# EAGLE design carcomputer2 (EAGLE 9.3.2)
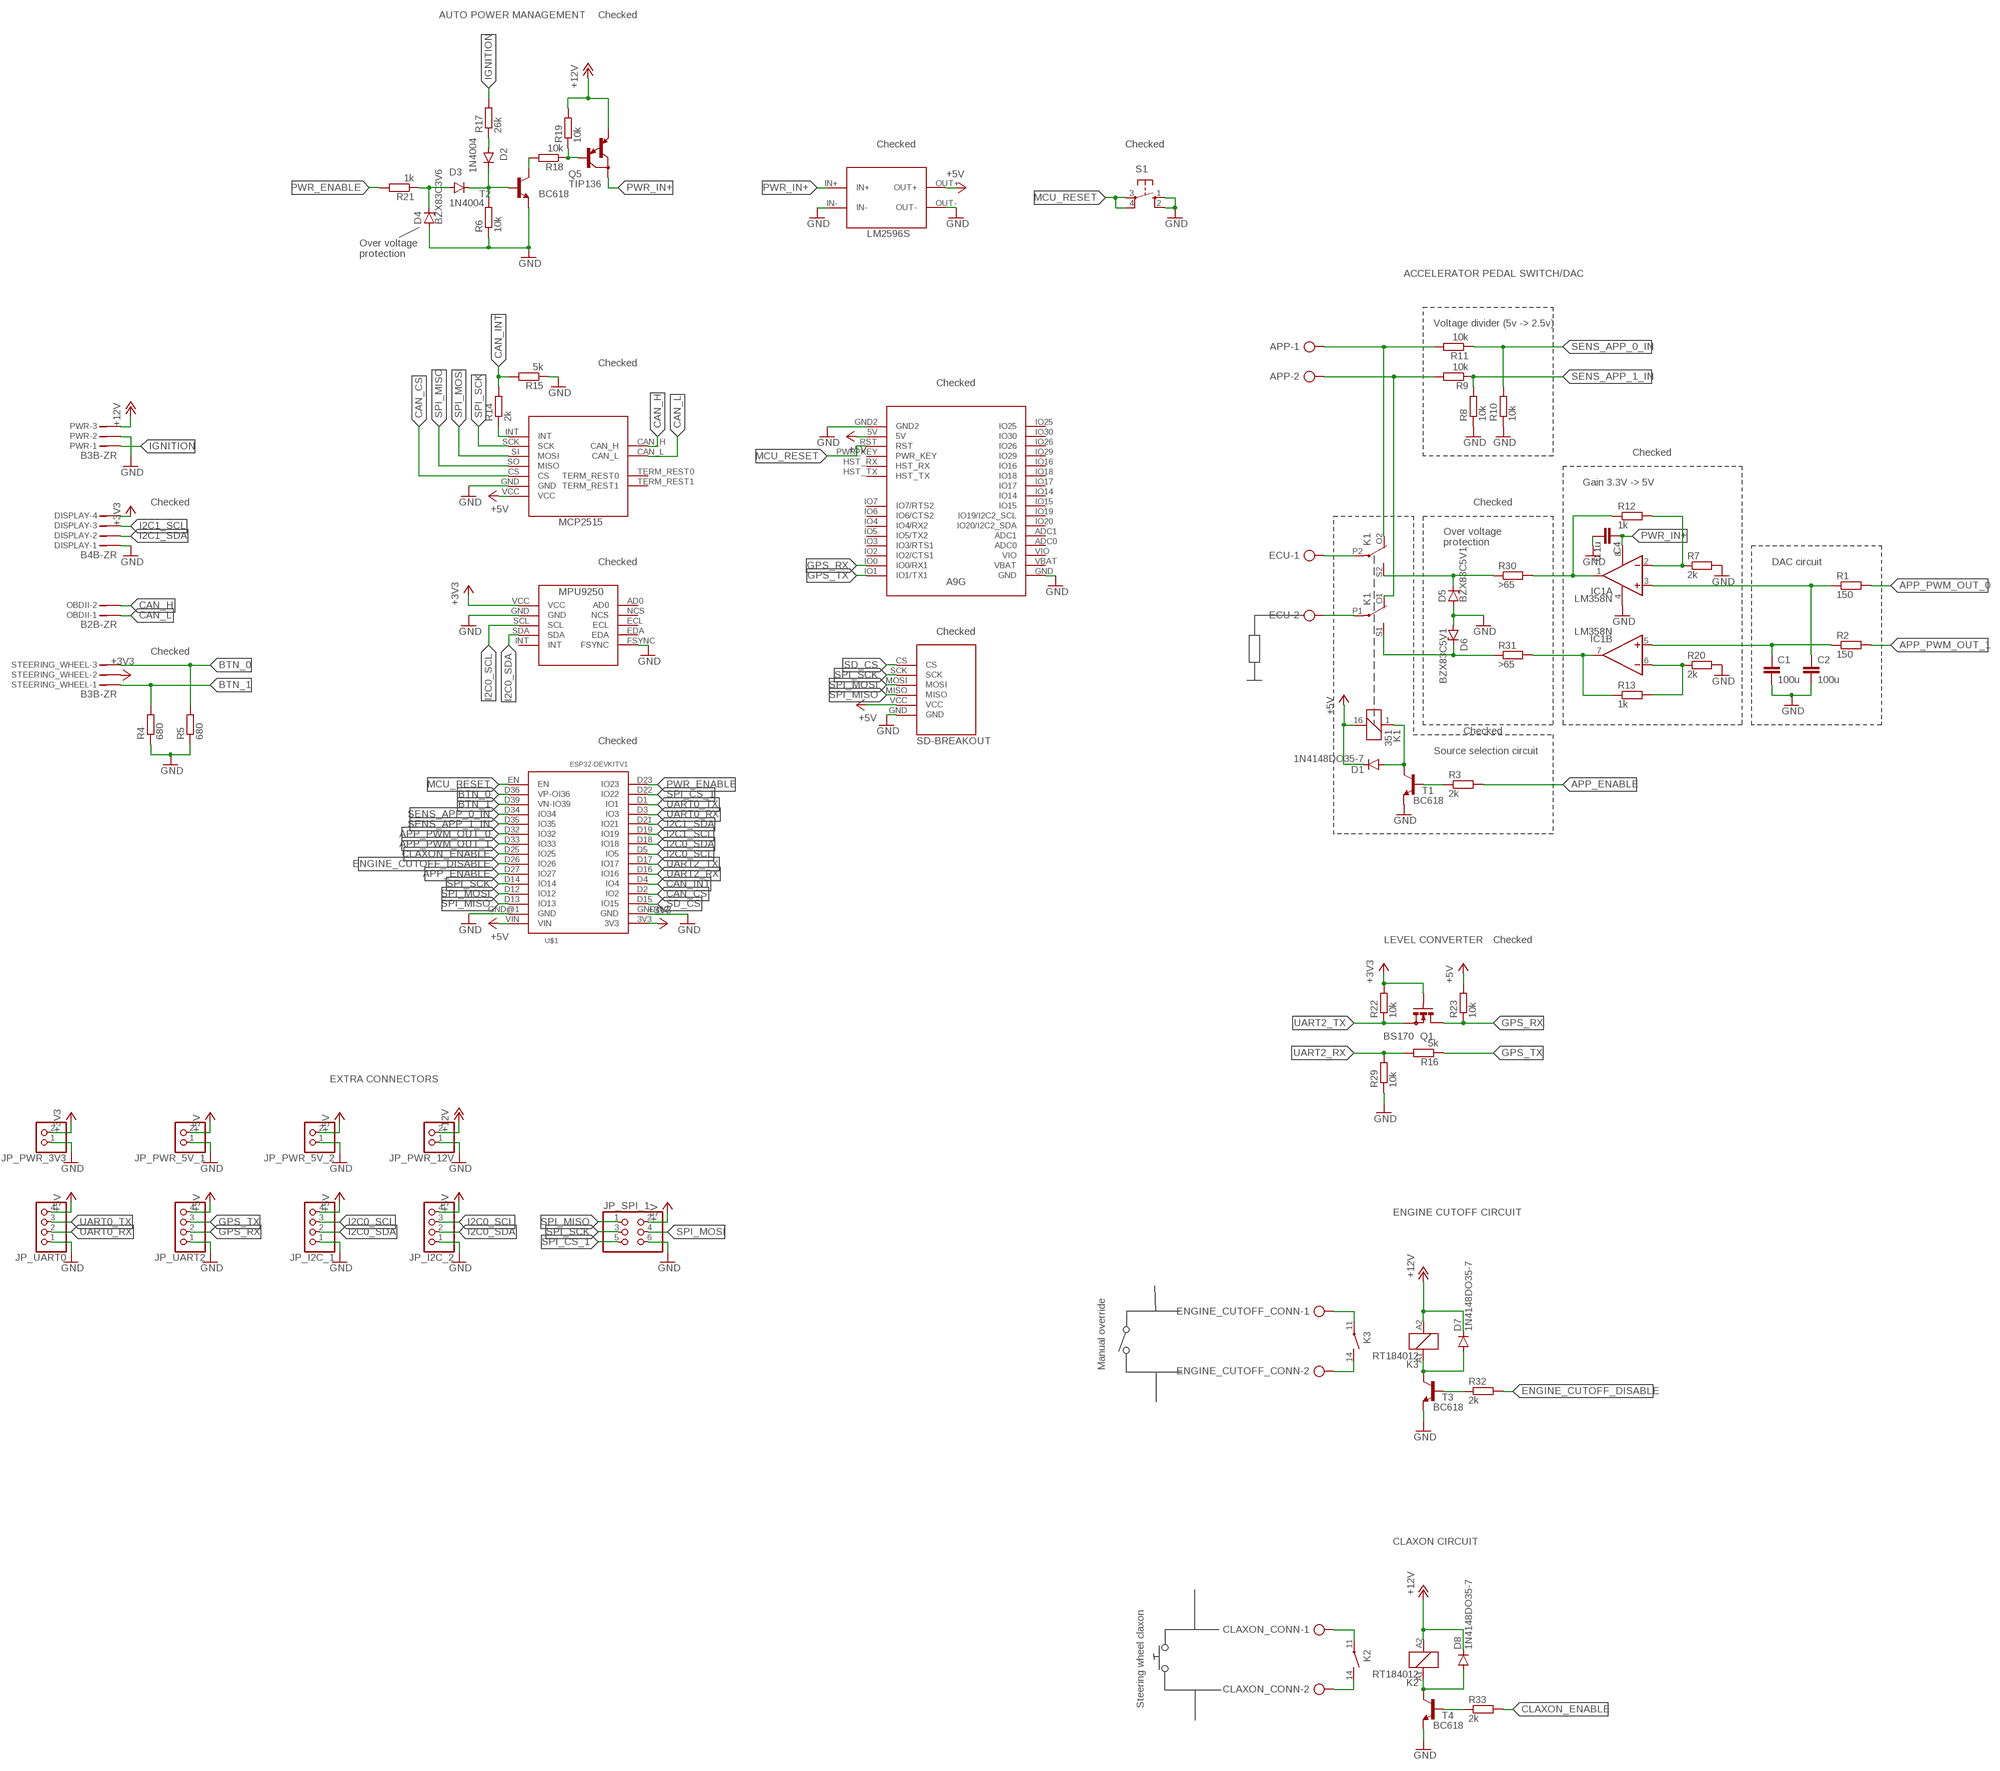
[diagram p0: schematic, sheet 1]

## Parts
APP  AK300/2  [AK300/2]
C1  100u  C-EU025-050X050  [C025-050X050]
C2  100u  C-EU025-050X050  [C025-050X050]
C4  0.1u  C-EU025-050X050  [C025-050X050]
CLAXON_CONN  AK300/2  [AK300/2]
D1  1N4148DO35-7  [DO35-7]
D2  1N4004  [DO41-10]
D3  1N4004  [DO41-10]
D4  BZX83C3V6  BZX85  [DO41Z10]
D5  BZX83C5V1  BZX85  [DO41Z10]
D6  BZX83C5V1  BZX85  [DO41Z10]
D7  1N4148DO35-7  [DO35-7]
D8  1N4148DO35-7  [DO35-7]
DISPLAY  B4B-ZR  [B4B-ZR]
ECU  AK300/2  [AK300/2]
ENGINE_CUTOFF_CONN  AK300/2  [AK300/2]
IC1  LM358N  [DIL08]
JP_I2C_1  PINHD-1X4  [1X04]
JP_I2C_2  PINHD-1X4  [1X04]
JP_PWR_3V3  PINHD-1X2  [1X02]
JP_PWR_5V_1  PINHD-1X2  [1X02]
JP_PWR_5V_2  PINHD-1X2  [1X02]
JP_PWR_12V  PINHD-1X2  [1X02]
JP_SPI_1  PINHD-2X3  [2X03]
JP_UART0  PINHD-1X4  [1X04]
JP_UART2  PINHD-1X4  [1X04]
K1  351  [351]
K2  RT184012  [RT-N/O12A3.5]
K3  RT184012  [RT-N/O12A3.5]
OBDII  B2B-ZR  [B2B-ZR]
PWR  B3B-ZR  [B3B-ZR]
Q1  BS170  [SOT54E]
Q5  TIP136  [TO220]
R1  150  R-EU_0207/7  [0207/7]
R2  150  R-EU_0207/7  [0207/7]
R3  2k  R-EU_0207/7  [0207/7]
R4  680  R-EU_0207/7  [0207/7]
R5  680  R-EU_0207/7  [0207/7]
R6  10k  R-EU_0207/7  [0207/7]
R7  2k  R-EU_0207/7  [0207/7]
R8  10k  R-EU_0207/7  [0207/7]
R9  10k  R-EU_0207/7  [0207/7]
R10  10k  R-EU_0207/7  [0207/7]
R11  10k  R-EU_0207/7  [0207/7]
R12  1k  R-EU_0207/7  [0207/7]
R13  1k  R-EU_0207/7  [0207/7]
R14  2k  R-EU_0207/7  [0207/7]
R15  5k  R-EU_0207/7  [0207/7]
R16  5k  R-EU_0207/7  [0207/7]
R17  26k  R-EU_0207/7  [0207/7]
R18  10k  R-EU_0207/7  [0207/7]
R19  10k  R-EU_0207/7  [0207/7]
R20  2k  R-EU_0207/7  [0207/7]
R21  1k  R-EU_0207/7  [0207/7]
R22  10k  R-EU_0207/7  [0207/7]
R23  10k  R-EU_0207/7  [0207/7]
R29  10k  R-EU_0207/7  [0207/7]
R30  >65  R-EU_0207/7  [0207/7]
R31  >65  R-EU_0207/7  [0207/7]
R32  2k  R-EU_0207/7  [0207/7]
R33  2k  R-EU_0207/7  [0207/7]
S1  10-XX  [B3F-10XX]
STEERING_WHEEL  B3B-ZR  [B3B-ZR]
T1  BC618  [TO92-EBC]
T2  BC618  [TO92-EBC]
T3  BC618  [TO92-EBC]
T4  BC618  [TO92-EBC]
U$1  ESP32DEVKITV1  [ESP32-DEVKITV1]
U$2  MCP2515_DEVBOARDINVERTED  [MCP2515_DEVBOARD_INVERTED]
U$3  MPU9250_BREAKOUT  [MPU9250_BREAKOUT]
U$4  LM2596S  [LM2596S]
U$5  HKD-MICRO-SD-BREAKOUT  [HKD-MICRO-SD-BREAKOUT]
U$6  A9G  [A9G]

## Nets
+3V3: DISPLAY.4 JP_PWR_3V3.2 Q1.G R22.2 STEERING_WHEEL.2 U$1.3V3 U$3.VCC
+5V: D1.C JP_I2C_1.4 JP_I2C_2.4 JP_PWR_5V_1.2 JP_PWR_5V_2.2 JP_SPI_1.2 JP_UART0.4 JP_UART2.4 K1.16 R23.2 U$1.VIN U$2.VCC U$4.OUT+ U$5.VCC U$6.5V
+12V: D7.C D8.C JP_PWR_12V.2 K2.A2 K3.A2 PWR.3 Q5.3(E) R19.2
APP_0_IN: APP.1 K1.O2(3:O) R11.2
APP_1_IN: APP.2 K1.O1(2:O) R9.2
APP_ENABLE: R3.2 U$1.D27(IO27)
APP_PWM_OUT_0: R1.2 U$1.D32(IO32)
APP_PWM_OUT_1: R2.2 U$1.D33(IO33)
BTN_0: R5.2 STEERING_WHEEL.3 U$1.D36(VP-OI36)
BTN_1: R4.2 STEERING_WHEEL.1 U$1.D39(VN-IO39)
CAN_CS: U$1.D2(IO2) U$2.CS
CAN_H: OBDII.2 U$2.CAN_H
CAN_INT: R14.2 R15.2 U$1.D4(IO4)
CAN_L: OBDII.1 U$2.CAN_L
CLAXON_ENABLE: R33.2 U$1.D25(IO25)
ENGINE_CUTOFF_DISABLE: R32.2 U$1.D26(IO26)
GND: C1.2 C2.2 C4.2 D4.A D5.A D6.A DISPLAY.1 IC1.4(P:V-) JP_I2C_1.1 JP_I2C_2.1 JP_PWR_3V3.1 JP_PWR_5V_1.1 JP_PWR_5V_2.1 JP_PWR_12V.1 JP_SPI_1.6 JP_UART0.1 JP_UART2.1 PWR.2 R4.1 R5.1 R6.1 R7.2 R8.1 R10.1 R15.1 R20.2 R29.1 S1.1(S) S1.2(S1) T1.E T2.E T3.E T4.E U$1.GND@1(GND) U$1.GND@2(GND) U$2.GND U$3.FSYNC U$3.GND U$4.IN- U$4.OUT- U$5.GND U$6.GND U$6.GND2
GPS_RX: JP_UART2.2 Q1.D R23.1 U$6.IO0(IO0/RX1)
GPS_TX: JP_UART2.3 R16.1 U$6.IO1(IO1/TX1)
I2C0_SCL: JP_I2C_1.3 JP_I2C_2.3 U$1.D5(IO5) U$3.SCL
I2C0_SDA: JP_I2C_1.2 JP_I2C_2.2 U$1.D18(IO18) U$3.SDA
I2C1_SCL: DISPLAY.3 U$1.D19(IO19)
I2C1_SDA: DISPLAY.2 U$1.D21(IO21)
IGNITION: PWR.1 R17.2
MCU_RESET: S1.3(P) S1.4(P1) U$1.EN U$6.RST
N$1: D1.A K1.1 T1.C
N$2: R3.1 T1.B
N$3: D6.C K1.S1(2:S) R31.1
N$4: IC1.1(A:OUT) R12.1 R30.2
N$5: D2.C D3.C R6.2 T2.B
N$6: ECU.2 K1.P1(2:P)
N$7: ECU.1 K1.P2(3:P)
N$8: C2.1 IC1.3(A:+IN) R1.1
N$9: C1.1 IC1.5(B:+IN) R2.1
N$10: R14.1 U$2.INT
N$11: D3.A D4.C R21.1
N$12: D2.A R17.1
N$13: IC1.2(A:-IN) R7.1 R12.2
N$14: Q5.1(B) R18.1 R19.1
N$15: R18.2 T2.C
N$16: IC1.6(B:-IN) R13.2 R20.1
N$17: D5.C K1.S2(3:S) R30.1
N$18: IC1.7(B:OUT) R13.1 R31.2
N$19: ENGINE_CUTOFF_CONN.1 K3.11(2:P)
N$20: ENGINE_CUTOFF_CONN.2 K3.14(2:S)
N$22: D7.A K3.A1 T3.C
N$23: D8.A K2.A1 T4.C
N$25: R33.1 T4.B
N$26: R32.1 T3.B
N$27: CLAXON_CONN.1 K2.11(2:P)
N$28: CLAXON_CONN.2 K2.14(2:S)
PWR_ENABLE: R21.2 U$1.D23(IO23)
PWR_IN+: C4.1 IC1.8(P:V+) Q5.2(C) U$4.IN+
SD_CS: U$1.D15(IO15) U$5.CS
SENS_APP_0_IN: R10.2 R11.1 U$1.D34(IO34)
SENS_APP_1_IN: R8.2 R9.1 U$1.D35(IO35)
SPI_CS_1: JP_SPI_1.5 U$1.D22(IO22)
SPI_MISO: JP_SPI_1.1 U$1.D13(IO13) U$2.SO(MISO) U$5.MISO
SPI_MOSI: JP_SPI_1.4 U$1.D12(IO12) U$2.SI(MOSI) U$5.MOSI
SPI_SCK: JP_SPI_1.3 U$1.D14(IO14) U$2.SCK U$5.SCK
UART0_RX: JP_UART0.2 U$1.D3(IO3)
UART0_TX: JP_UART0.3 U$1.D1(IO1)
UART2_RX: R16.2 R29.2 U$1.D16(IO16)
UART2_TX: Q1.S R22.1 U$1.D17(IO17)
Unconnected: U$2.TERM_REST0 U$2.TERM_REST1 U$3.AD0 U$3.ECL U$3.EDA U$3.INT U$3.NCS U$6.ADC0 U$6.ADC1 U$6.HST_RX U$6.HST_TX U$6.IO2(IO2/CTS1) U$6.IO3(IO3/RTS1) U$6.IO4(IO4/RX2) U$6.IO5(IO5/TX2) U$6.IO6(IO6/CTS2) U$6.IO7(IO7/RTS2) U$6.IO14 U$6.IO15 U$6.IO16 U$6.IO17 U$6.IO18 U$6.IO19(IO19/I2C2_SCL) U$6.IO20(IO20/I2C2_SDA) U$6.IO25 U$6.IO26 U$6.IO29 U$6.IO30 U$6.PWR_KEY U$6.VBAT U$6.VIO

## Notes on the sheet
- AUTO POWER MANAGEMENT | Checked
- Checked | Checked
- Over voltage
  protection
- ACCELERATOR PEDAL SWITCH/DAC
- Voltage divider (5v -> 2.5v)
- Checked
- Checked
- Checked
- Gain 3.3V -> 5V
- Checked | Checked
- Over voltage
  protection
- Checked | DAC circuit
- Checked
- Checked
- Checked
- Checked
- Source selection circuit
- LEVEL CONVERTER | Checked
- EXTRA CONNECTORS
- ENGINE CUTOFF CIRCUIT
- Manual override
- CLAXON CIRCUIT
- Steering wheel claxon

## Library data of the parts
APP CLAXON_CONN ECU ENGINE_CUTOFF_CONN = con-ptr500-custom:AK300/2: CONNECTOR; OC_FARNELL: unknown; OC_NEWARK: unknown
C1 C2 C4 = rcl:C-EU: CAPACITOR, European symbol; SPICEPREFIX: C
D1 D7 D8 = diode:1N4148: DIODE high speed (Philips)
D2 D3 = diode:1N4004: DIODE general purpose rectifier, 1 A
D4-D6 = diode:BZX85: Z DIODE
DISPLAY = con-jst-custom:?4B-ZR: ZH CONNECTOR 1.5 mm, 4 pin 1 row Source: http://www.jst.com .. eZH.pdf; MF: FARNELL; MPN: B4B-ZR(LF)(SN); OC_FARNELL: 1830916; OC_NEWARK: 37K9960
IC1 = linear:LM358: OP AMP also LM158; LM258; LM2904 Source: http://cache.national.com/ds/LM/LM158.pdf
JP_I2C_1 JP_I2C_2 JP_UART0 JP_UART2 = pinhead:PINHD-1X4: PIN HEADER
JP_PWR_3V3 JP_PWR_5V_1 JP_PWR_5V_2 JP_PWR_12V = pinhead:PINHD-1X2: PIN HEADER
JP_SPI_1 = pinhead:PINHD-2X3: PIN HEADER
K1 = relay:351: RELAY 2 x switch, Omron; OC_FARNELL: unknown; OC_NEWARK: unknown
K2 K3 = relay:RT?*: Power PCB Relay SCHRACK 1 pole 12 / 16 A, DC- or AC-coil Source: http://www.schrack.com/.. 5819.pdf; MF: TYCO ELECTRONICS; MPN: RT184012; OC_FARNELL: unknown; OC_NEWARK: 08H3731
OBDII = con-jst-custom:?2B-ZR: ZH CONNECTOR 1.5 mm, 4 pin 1 row Source: http://www.jst.com .. eZH.pdf
PWR STEERING_WHEEL = con-jst-custom:?3B-ZR: ZH CONNECTOR 1.5 mm, 4 pin 1 row Source: http://www.jst.com .. eZH.pdf
Q1 = transistor-small-signal:BS170: N-CHANNEL MOS FET
Q5 = transistor-pnp:TIP136: PNP Darlington Transistor
R1-R23 R29-R33 = rcl:R-EU_: RESISTOR, European symbol; SPICEPREFIX: R
S1 = switch-omron:10-XX: OMRON SWITCH; MPN: B3F-1000; OC_FARNELL: 176432; OC_NEWARK: 36M3542
T1-T4 = transistor-npn:BC618*: NPN Transistor
U$1 = ESP32-DEVKITV1:ESP32DEVKITV1
U$2 = MCP2515:MCP2515_DEVBOARD
U$3 = MPU9250:MPU9250_BREAKOUT
U$4 = PSU:LM2596S
U$5 = sd-mmc:HKD-MICRO-SD-BREAKOUT
U$6 = A9:A9G

## Board
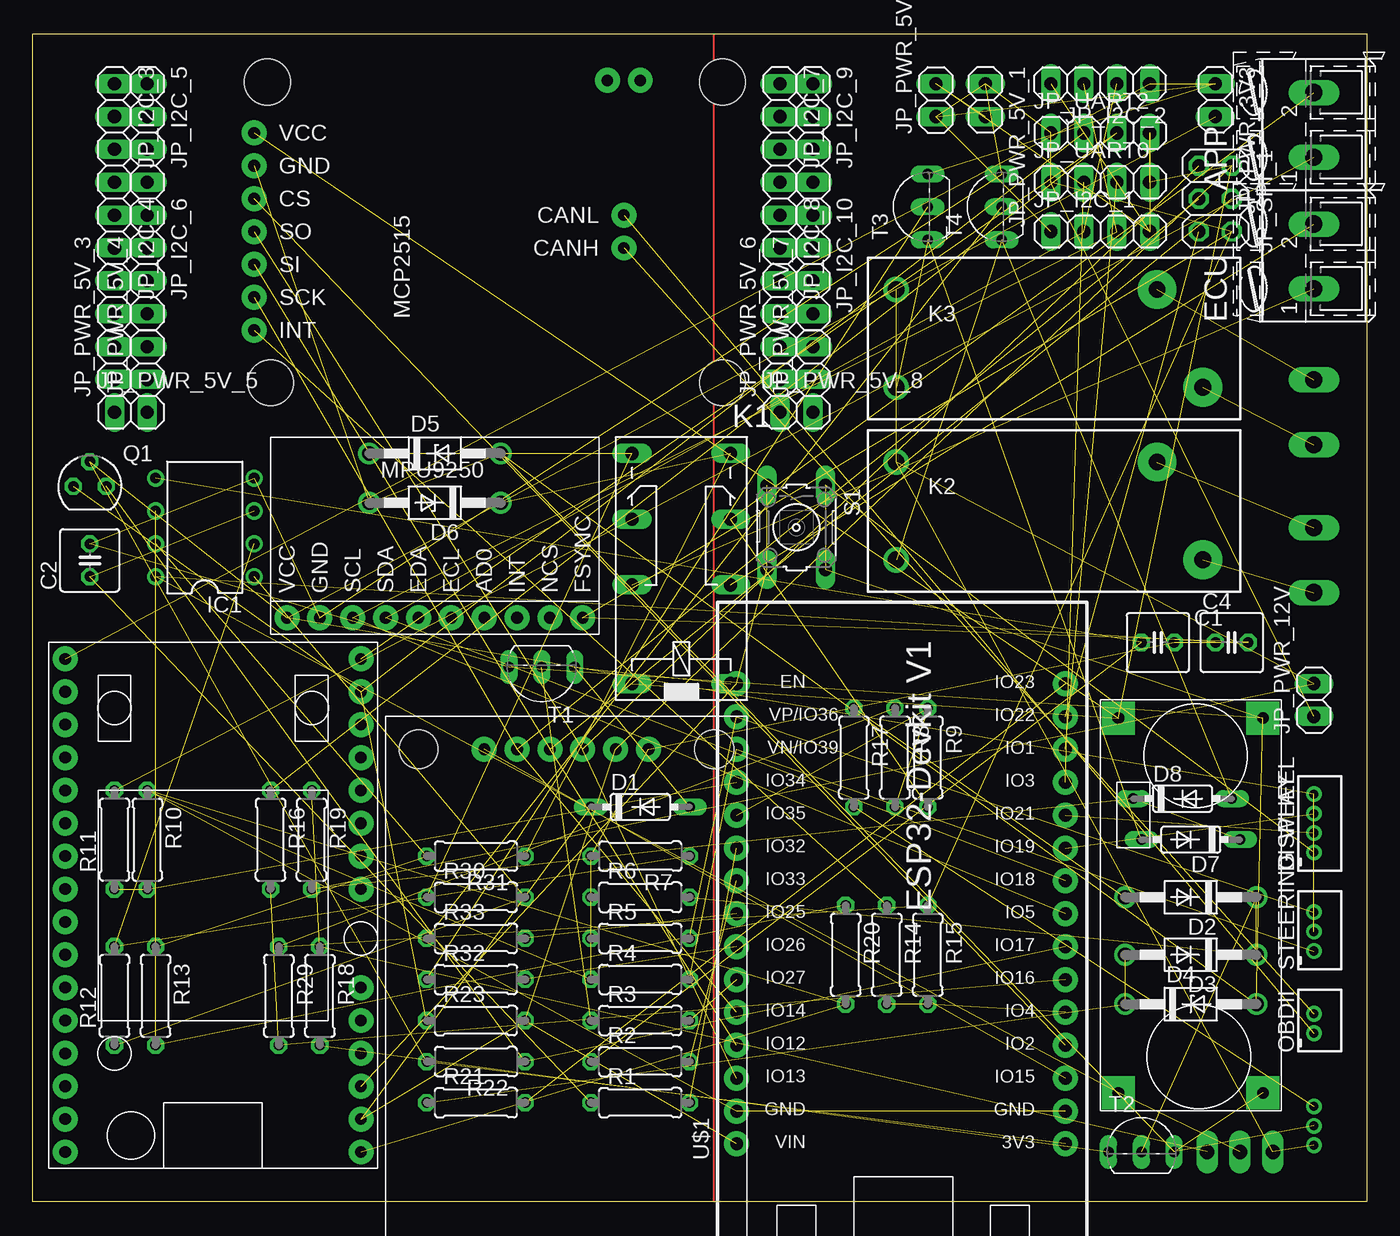
[diagram p1: board, top side]
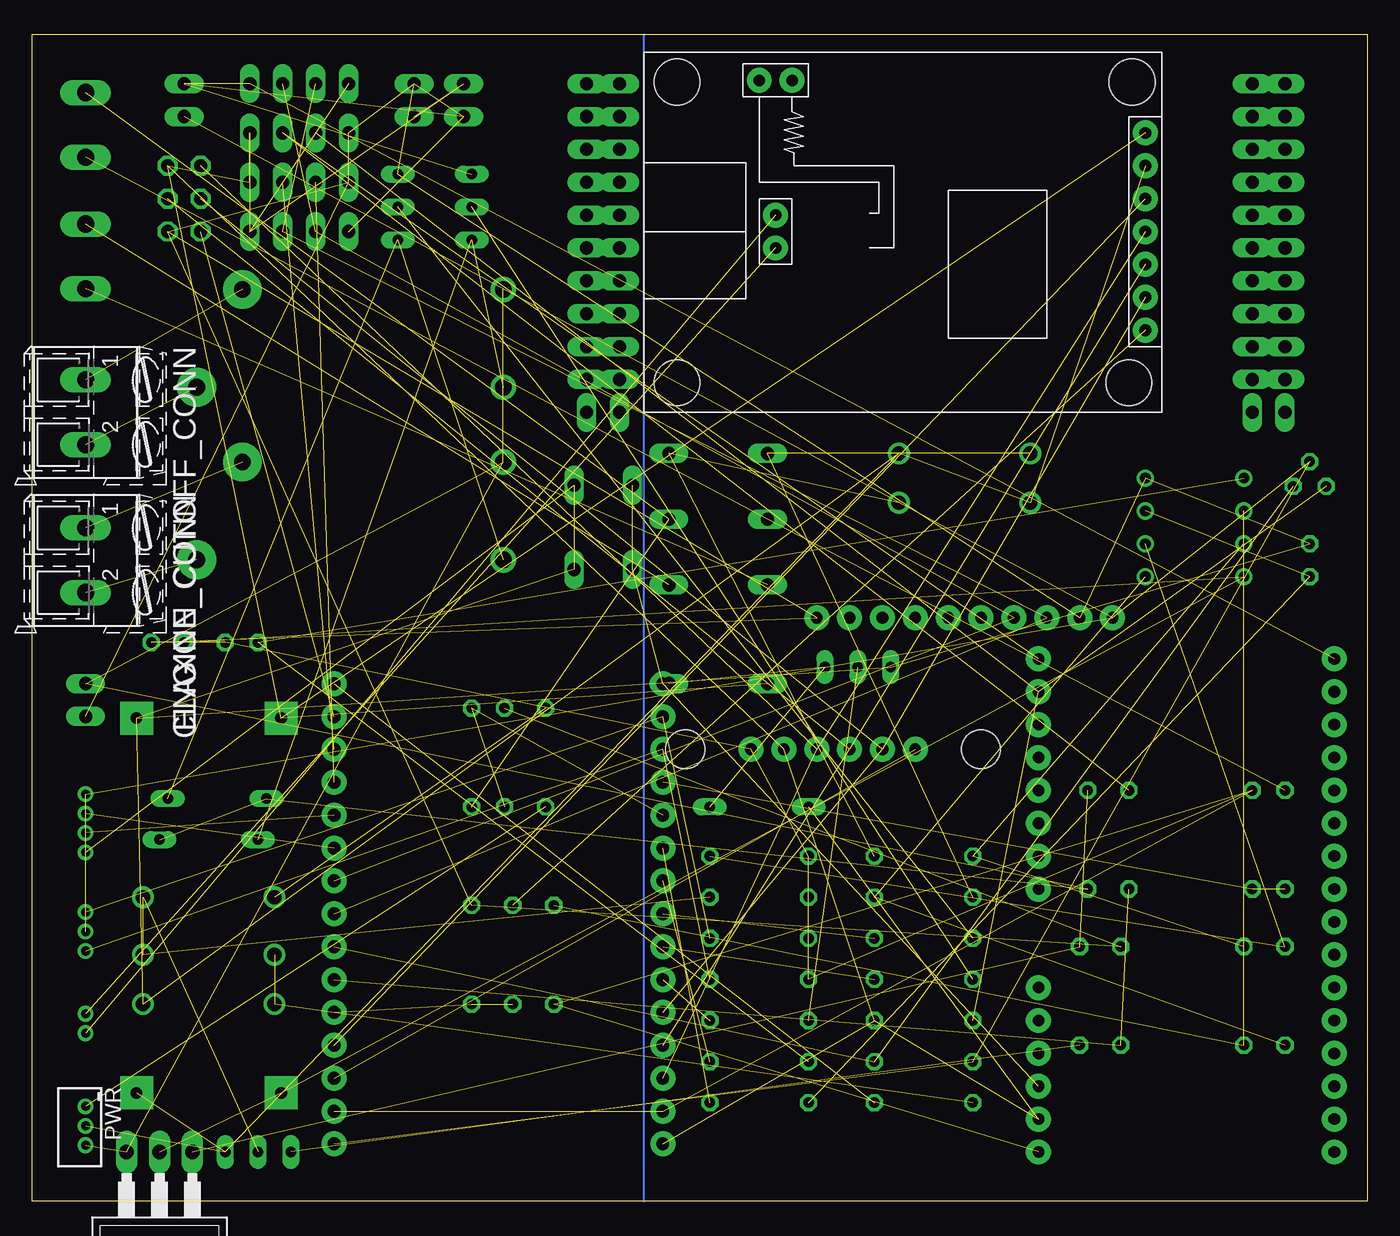
[diagram p2: board, bottom side, seen from below]

Size 103.18 x 90.16 mm. Coordinates in mm from the lower left corner, seen from the top.
Outline: 0,0 103.18,0 103.18,90.16 0,90.16 0,0
Copper layers (1*16): Top 0.035mm / dielectric 1.5mm / Bottom 0.035mm
Design rules "default": minimum track width 6mil, minimum drill 0.35mm, track to track 6mil, track to pad 6mil, pad to pad 6mil, via to via 6mil, smd to smd 6mil, copper to edge 40mil, drill to drill 6mil, minimum pad ring 10mil, minimum via ring 8mil, stop-mask expansion 4mil, vias tented up to drill 0mil, thermal gap 10mil

### Footprints (pad centres in the part's own frame; a part is rotated, then mirrored left to right if it is on the bottom)
AK300/2 = drill 1.321 long: 1 -2.515,0; 2 2.489,0
C025-050X050 = drill 0.813 octagon: 1 -1.27,0; 2 1.27,0
DO35-7 = drill 0.813 long: A 3.81,0; C -3.81,0
DO41-10 = drill 1.118: A 5.08,0; C -5.08,0
DO41Z10 = drill 1.118: A 5.08,0; C -5.08,0
B4B-ZR = drill 0.7 pad 1.1: 1 -2.25,0; 2 -0.75,0; 3 0.75,0; 4 2.25,0
DIL08 = drill 0.813 pad 1.27: 1 -3.81,-3.81; 2 -1.27,-3.81; 3 1.27,-3.81; 4 3.81,-3.81; 5 3.81,3.81; 6 1.27,3.81; 7 -1.27,3.81; 8 -3.81,3.81
1X04 = drill 1.016 long: 1 -3.81,0; 2 -1.27,0; 3 1.27,0; 4 3.81,0
1X02 = drill 1.016 long: 1 -1.27,0; 2 1.27,0
2X03 = drill 1.016 octagon: 1 -2.54,-1.27; 2 -2.54,1.27; 3 0,-1.27; 4 0,1.27; 5 2.54,-1.27; 6 2.54,1.27
351 = drill 1.016 long: 1 -3.81,-3.81; 16 -3.81,3.81; O1 8.89,-3.81; O2 8.89,3.81; P1 3.81,-3.81; P2 3.81,3.81; S1 13.97,-3.81; S2 13.97,3.81
RT-N/O12A3.5 = drill 1.3 pad 3: 11 7.56,3.78; 14 11.1,-3.78 | drill 1.3: A1 -12.6,-3.78; A2 -12.6,3.78
B2B-ZR = drill 0.7 pad 1.1: 1 -2.25,0; 2 -0.75,0
B3B-ZR = drill 0.7 pad 1.1: 1 -2.25,0; 2 -0.75,0; 3 0.75,0
SOT54E = drill 0.813 octagon: D -1.27,0; G 0,1.905; S 1.27,0
TO220 = drill 1.118 long: 1 -2.54,-6.35; 2 0,-6.35; 3 2.54,-6.35 | hole 3.302: 0,11.176
0207/7 = drill 0.813 octagon: 1 -3.81,0; 2 3.81,0
B3F-10XX = drill 1.016 long: 1 -3.251,2.261; 2 3.251,2.261; 3 -3.251,-2.261; 4 3.251,-2.261
TO92-EBC = drill 0.813 long: B 0,-1.27; C -2.54,-1.27; E 2.54,-1.27
ESP32-DEVKITV1 = drill 1 pad 1.93: 3V3 -15.25,-12.54; D1 15.23,-12.54; D2 -7.63,-12.54; D3 12.69,-12.54; D4 -5.09,-12.54; D5 2.53,-12.54; D12 -7.63,12.865; D13 -10.17,12.865; D14 -5.09,12.865; D15 -10.17,-12.54; D16 -2.55,-12.54; D17 -0.01,-12.54; D18 5.07,-12.54; D19 7.61,-12.54; D21 10.15,-12.54; D22 17.77,-12.54; D23 20.31,-12.54; D25 2.53,12.865; D26 -0.01,12.865; D27 -2.55,12.865; D32 7.61,12.865; D33 5.07,12.865; D34 12.69,12.865; D35 10.15,12.865; D36 17.77,12.865; D39 15.23,12.865; EN 20.31,12.865; GND@1 -12.71,12.865; GND@2 -12.71,-12.54; VIN -15.25,12.865
MCP2515_DEVBOARD_INVERTED = drill 0.9 pad 1.93: CAN_H 9.525,-1.27; CAN_L 9.525,1.27; CS -19.05,2.54; GND -19.05,5.08; INT -19.05,-7.62; SCK -19.05,-5.08; SI -19.05,-2.54; SO -19.05,0; TERM_REST0 8.255,11.684; TERM_REST1 10.795,11.684; VCC -19.05,7.62 | hole 3.556: -17.78,-11.684; 17.145,-11.684; 17.145,11.557; -18.034,11.557
MPU9250_BREAKOUT = drill 0.9 pad 1.93: AD0 -6.35,-3.81; ECL -6.35,-1.27; EDA -6.35,1.27; FSYNC -6.35,-11.43; GND -6.35,8.89; INT -6.35,-6.35; NCS -6.35,-8.89; SCL -6.35,6.35; SDA -6.35,3.81; VCC -6.35,11.43
LM2596S = drill 0.9 pad 2.54 square: IN+ -13.843,6.223; IN- -13.843,-4.953; OUT+ 15.113,6.223; OUT- 15.113,-4.953
HKD-MICRO-SD-BREAKOUT = drill 0.9 pad 1.93: CS -20.32,-7.62; GND -20.32,5.08; MISO -20.32,0; MOSI -20.32,-2.54; SCK -20.32,-5.08; VCC -20.32,2.54 | hole 2.997: -20.32,10.16; -20.32,-12.7; 20.32,10.16; 20.32,-12.7
A9G = drill 0.9 pad 1.93: 5V -11.43,16.51; ADC0 11.43,-11.43; ADC1 11.43,-8.89; GND 11.43,-19.05; GND2 -11.43,19.05; HST_RX -11.43,8.89; HST_TX -11.43,6.35; IO0 -11.43,-16.51; IO1 -11.43,-19.05; IO2 -11.43,-13.97; IO3 -11.43,-11.43; IO4 -11.43,-6.35; IO5 -11.43,-8.89; IO6 -11.43,-3.81; IO7 -11.43,-1.27; IO14 11.43,1.27; IO15 11.43,-1.27; IO16 11.43,8.89; IO17 11.43,3.81; IO18 11.43,6.35; IO19 11.43,-3.81; IO20 11.43,-6.35; IO25 11.43,19.05; IO26 11.43,13.97; IO29 11.43,11.43; IO30 11.43,16.51; PWR_KEY -11.43,11.43; RST -11.43,13.97; VBAT 11.43,-16.51; VIO 11.43,-13.97

### Placement (x,y rotation side)
APP  99.06,83.19 90 top
C1  87,43.18 0 top
C2  4.45,49.53 90 top
C4  92.71,43.18 0 top
CLAXON_CONN  99.06,49.53 270 bottom
D1  46.99,30.48 0 top
D2  89.54,23.49 180 top
D3  89.54,19.05 180 top
D4  89.54,15.24 0 top
D5  31.11,57.79 0 top
D6  31.11,53.98 180 top
D7  89.54,27.94 180 top
D8  88.9,31.11 0 top
DISPLAY  99.06,29.21 90 top
ECU  99.06,73.03 90 top
ENGINE_CUTOFF_CONN  99.06,60.96 270 bottom
IC1  13.34,52.07 90 top
JP_I2C_1  82.55,74.93 0 top
JP_I2C_2  82.55,86.36 180 top
JP_I2C_3  [1X04]  6.35,82.55 270 top
JP_I2C_4  [1X04]  6.35,72.39 270 top
JP_I2C_5  [1X04]  8.89,82.55 270 top
JP_I2C_6  [1X04]  8.89,72.39 270 top
JP_I2C_7  [1X04]  57.78,82.55 270 top
JP_I2C_8  [1X04]  57.78,72.39 270 top
JP_I2C_9  [1X04]  60.32,82.55 270 top
JP_I2C_10  [1X04]  60.32,72.39 270 top
JP_PWR_3V3  91.44,85.09 270 top
JP_PWR_5V_1  73.66,85.09 270 top
JP_PWR_5V_2  69.85,85.09 90 top
JP_PWR_5V_3  [1X02]  6.35,64.77 90 top
JP_PWR_5V_4  [1X02]  8.89,64.77 90 top
JP_PWR_5V_5  [1X02]  7.62,60.96 0 top
JP_PWR_5V_6  [1X02]  57.78,64.77 90 top
JP_PWR_5V_7  [1X02]  60.32,64.77 90 top
JP_PWR_5V_8  [1X02]  59.05,60.96 0 top
JP_PWR_12V  99.06,38.73 90 top
JP_SPI_1  91.44,77.47 270 top
JP_UART0  82.55,78.74 0 top
JP_UART2  82.55,82.55 0 top
K1  50.16,43.82 90 top
K2  79.38,53.34 0 top
K3  79.38,66.67 0 top
OBDII  99.06,15.24 90 top
PWR  99.06,5.08 270 bottom
Q1  4.45,55.25 0 top
Q5  93.35,-2.54 180 bottom
R1  46.99,7.62 0 top
R2  46.99,10.79 0 top
R3  46.99,13.97 0 top
R4  46.99,17.14 0 top
R5  46.99,20.32 0 top
R6  46.99,23.49 0 top
R7  46.99,26.67 180 top
R8  66.68,34.29 270 top
R9  69.22,34.29 270 top
R10  8.89,27.94 270 top
R11  6.35,27.94 90 top
R12  6.35,15.88 90 top
R13  9.53,15.88 270 top
R14  66.04,19.05 270 top
R15  69.22,19.05 270 top
R16  18.41,27.94 270 top
R17  63.5,34.29 270 top
R18  22.22,15.88 270 top
R19  21.59,27.94 270 top
R20  62.87,19.05 270 top
R21  34.29,7.62 0 top
R22  34.29,10.79 180 top
R23  34.29,13.97 0 top
R29  19.05,15.88 270 top
R30  34.29,23.49 0 top
R31  34.29,26.67 180 top
R32  34.29,17.14 0 top
R33  34.29,20.32 0 top
S1  59.05,52.07 270 top
STEERING_WHEEL  99.06,21.59 90 top
T1  39.37,40.01 180 top
T2  85.73,5.08 0 top
T3  67.95,76.84 90 top
T4  73.66,76.84 90 top
U$1  67.31,19.68 90 top
U$2  36.2,74.93 0 top
U$3  31.11,51.44 90 top
U$4  90.17,22.22 90 top
U$5  42.55,14.61 270 top
U$6  13.97,22.86 180 top

### Tracks (layer width: path | path; a pad name or v marks a point on that pad's centre or on a via)
+3V3  (6 unrouted)
+5V  (14 unrouted)
+12V  (7 unrouted)
APP_0_IN  (2 unrouted)
APP_1_IN  (2 unrouted)
APP_ENABLE  (1 unrouted)
APP_PWM_OUT_0  (1 unrouted)
APP_PWM_OUT_1  (1 unrouted)
BTN_0  (2 unrouted)
BTN_1  (2 unrouted)
CAN_CS  (1 unrouted)
CAN_H  (1 unrouted)
CAN_INT  (2 unrouted)
CAN_L  (1 unrouted)
CLAXON_ENABLE  (1 unrouted)
ENGINE_CUTOFF_DISABLE  (1 unrouted)
GND  (42 unrouted)
GPS_RX  (3 unrouted)
GPS_TX  (2 unrouted)
I2C0_SCL  (3 unrouted)
I2C0_SDA  (3 unrouted)
I2C1_SCL  (1 unrouted)
I2C1_SDA  (1 unrouted)
IGNITION  (1 unrouted)
MCU_RESET  (3 unrouted)
N$1  (2 unrouted)
N$2  (1 unrouted)
N$3  (2 unrouted)
N$4  (2 unrouted)
N$5  (3 unrouted)
N$6  (1 unrouted)
N$7  (1 unrouted)
N$8  (2 unrouted)
N$9  (2 unrouted)
N$10  (1 unrouted)
N$11  (2 unrouted)
N$12  (1 unrouted)
N$13  (2 unrouted)
N$14  (2 unrouted)
N$15  (1 unrouted)
N$16  (2 unrouted)
N$17  (2 unrouted)
N$18  (2 unrouted)
N$19  (1 unrouted)
N$20  (1 unrouted)
N$21
  Top 0.152: 52.7,0 52.7,90.17
N$22  (2 unrouted)
N$23  (2 unrouted)
N$24
  Bottom 0.152: 55.88,0 55.88,90.17
N$25  (1 unrouted)
N$26  (1 unrouted)
N$27  (1 unrouted)
N$28  (1 unrouted)
PWR_ENABLE  (1 unrouted)
PWR_IN+  (3 unrouted)
SD_CS  (1 unrouted)
SENS_APP_0_IN  (2 unrouted)
SENS_APP_1_IN  (2 unrouted)
SPI_CS_1  (1 unrouted)
SPI_MISO  (3 unrouted)
SPI_MOSI  (3 unrouted)
SPI_SCK  (3 unrouted)
UART0_RX  (1 unrouted)
UART0_TX  (1 unrouted)
UART2_RX  (2 unrouted)
UART2_TX  (2 unrouted)